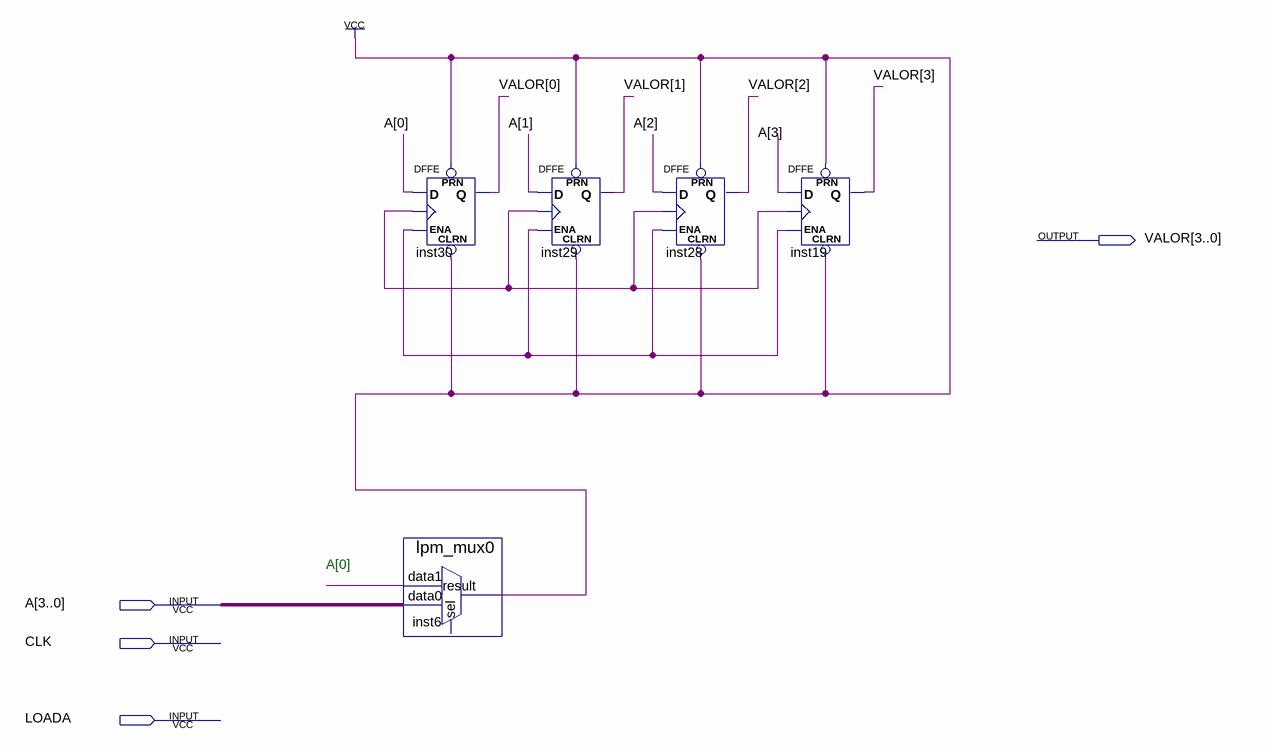
[diagram p0: schematic sheet]
// Quartus schematic RegistroA.bdf as structural Verilog: 5 symbols, 4 pins
module RegistroA (
  input  [3:0] A,
  input  CLK,
  input  LOADA,
  output [3:0] VALOR
);

  wire inst6_result, undriven, undriven_2, undriven_3;

  DFFE inst30 (.PRN(inst6_result), .CLRN(inst6_result), .D(A[0]), .CLK(undriven), .ENA(undriven_2), .Q(VALOR[0]));
  lpm_mux0 inst6 (.data1(undriven_3), .data0(A), .result(inst6_result));  // open: sel
  DFFE inst29 (.PRN(inst6_result), .CLRN(inst6_result), .D(A[1]), .CLK(undriven), .ENA(undriven_2), .Q(VALOR[1]));
  DFFE inst28 (.PRN(inst6_result), .CLRN(inst6_result), .D(A[2]), .CLK(undriven), .ENA(undriven_2), .Q(VALOR[2]));
  DFFE inst19 (.PRN(inst6_result), .CLRN(inst6_result), .D(A[3]), .CLK(undriven), .ENA(undriven_2), .Q(VALOR[3]));
  // also tied to VCC on the sheet: inst6_result

  // Notes on the sheet:
  //   A[0]
endmodule
